# Altium schematic sheet Battery Management.SchDoc: Battery Management
size A4; Organization: Altium Limited; Address1: L3, 12a Rodborough Rd; Address2: Frenchs Forest; Address3: NSW; Address4: Australia 2086; DocumentNumber: 7; Revision: D; SheetNumber: 7; SheetTotal: 7; Status: Develop
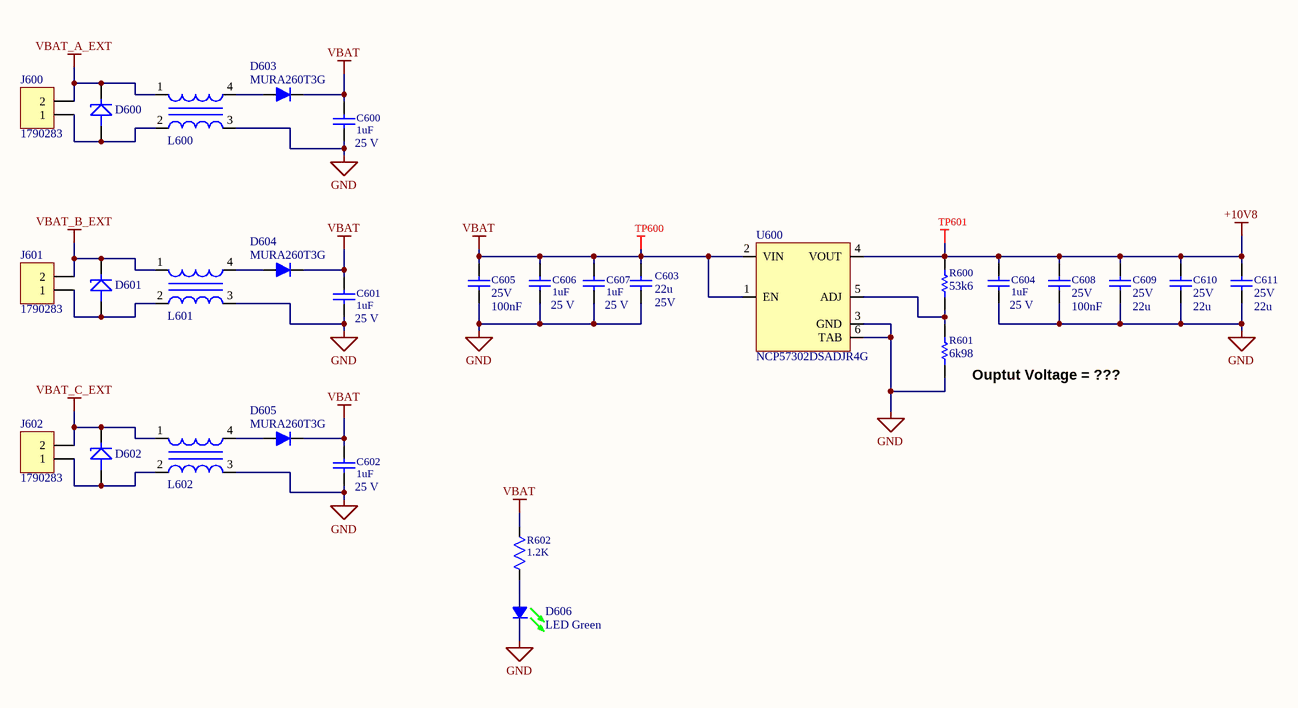
[diagram p0: Battery Management.SchDoc]

## Parts
C600  1uF  Voltage: 25 V  [C1608[0603] small]
C601  1uF  Voltage: 25 V  [C1608[0603] small]
C602  1uF  Voltage: 25 V  [C1608[0603] small]
C603  value 22u  Voltage: 25V  [CAPC2012X14N]
C604  1uF  Voltage: 25 V  [C1608[0603] small]
C605  value 100nF  Voltage: 25V  [CAPC1005X06N]  (hidden comment: 4.7uF)
C606  1uF  Voltage: 25 V  [C1608[0603] small]
C607  1uF  Voltage: 25 V  [C1608[0603] small]
C608  value 100nF  Voltage: 25V  [CAPC1005X06N]  (hidden comment: 4.7uF)
C609  value 22u  Voltage: 25V  [CAPC2012X14N]
C610  value 22u  Voltage: 25V  [CAPC2012X14N]
C611  value 22u  Voltage: 25V  [CAPC2012X14N]
D600  12V TVS  [NXP PTVSxS1UR-Series (SOD123W)]  (value not drawn)
D601  12V TVS  [NXP PTVSxS1UR-Series (SOD123W)]  (value not drawn)
D602  12V TVS  [NXP PTVSxS1UR-Series (SOD123W)]  (value not drawn)
D603  MURA260T3G  [Diode SMA DIOM5226X240N]
D604  MURA260T3G  [Diode SMA DIOM5226X240N]
D605  MURA260T3G  [Diode SMA DIOM5226X240N]
D606  LED Green  [LED_0603]
J600  1790283  [5.08mm 2pos TermBlock]
J601  1790283  [5.08mm 2pos TermBlock]
J602  1790283  [5.08mm 2pos TermBlock]
L600  CM3421Y600R-10  [CM3421Y600R-10]  (value not drawn)
L601  CM3421Y600R-10  [CM3421Y600R-10]  (value not drawn)
L602  CM3421Y600R-10  [CM3421Y600R-10]  (value not drawn)
R600  value 53k6  [RESC1608X06N]  (hidden comment: RES: GENERAL)
R601  value 6k98  [RESC1608X06N]  (hidden comment: RES: GENERAL)
R602  1.2K  [R1608[0603] small]
TP600  PAD  [TP_SMD_39MIL]  (value not drawn)  (no BOM)
TP601  PAD  [TP_SMD_39MIL]  (value not drawn)  (no BOM)
U600  NCP57302DSADJR4G  [D2PAK-5]

## Nets
+10V8: C604.2 C608.1 C609.1 C610.1 C611.1 R600.1 TP601.1 U600.4(VOUT)
GND: C600.1 C601.1 C602.1 C603.2 C604.1 C605.2 C606.1 C607.1 C608.2 C609.2 C610.2 C611.2 D606.2 L600.3 L601.3 L602.3 R601.2 U600.3(GND) U600.6(TAB)
VBAT: C600.2 C601.2 C602.2 C603.1 C605.1 C606.2 C607.2 D603.1(K) D604.1(K) D605.1(K) R602.2 TP600.1 U600.1(EN) U600.2(VIN)
VBAT_A_EXT: D600.1 J600.2 L600.1
VBAT_B_EXT: D601.1 J601.2 L601.1
VBAT_C_EXT: D602.1 J602.2 L602.1
NetD600_2: D600.2 J600.1 L600.2
NetD601_2: D601.2 J601.1 L601.2
NetD602_2: D602.2 J602.1 L602.2
NetD603_2: D603.2(A) L600.4
NetD604_2: D604.2(A) L601.4
NetD605_2: D605.2(A) L602.4
NetD606_1: D606.1 R602.1
NetR600_2: R600.2 R601.1 U600.5(ADJ)

## Notes on the sheet
- (near R601) Ouptut Voltage = ???
- Title
- Size:
- Date:
- A4
- Number:
- Time:
- Revision:
- Sheet
- of
- File:

## Library data of the parts
C600-C602 C604 C606 C607 = 1uF_0603_25V: CAP 1µF 25V ±10% X7R 0603; Manufacturer: Samsung; Manufacturer Part Number: CL10B105KA8NNNC; TZOA PN: 211-00001; Value: 1u; Supplier 1: Digi-Key; Stock 1: 622934; Pricing 1: 1=0.1, 10=0.069, 100=0.0307, 500=0.0219, 1000=0.0172 (USD); Capacitance: 1 µF; Case Size/Dimension: 0603; Dielectric: X7R; Tolerance (%): ±10 %; ComponentLink1URL: https://datasheet.ciiva.com/16449/cl10b105ka8nnnc-16449544.pdf; ComponentLink1Description: https://datasheet.ciiva.com/16449/cl10b105ka8nnnc-16449544.pdf; ComponentLink2URL: https://datasheet.ciiva.com/15195/getdatasheetpartid-359554-15195726.pdf; ComponentLink2Description: https://datasheet.ciiva.com/15195/getdatasheetpartid-359554-15195726.pdf; Supplier Part Number 1: 1276-1184-1-ND
C603 C609-C611 = 4.7uF_0603_10V: Manufacturer Part Number: GRM21BR61E226ME44K; Manufacturer: Murata; ComponentLink1URL: http://www.murata.com/~/media/webrenewal/support/library/catalog/products/capacitor/mlcc/c02e.pdf; ComponentLink1Description: http://www.murata.com/~/media/webrenewal/support/library/catalog/products/capacitor/mlcc/c02e.pdf; Supplier 1: Digi-Key; Supplier Part Number 1: 490-14661-1-ND
C605 C608 = 4.7uF_0603_10V: Manufacturer Part Number: CL05A104KA5NNNC; Manufacturer: Samsung; ComponentLink1URL: http://www.murata.com/~/media/webrenewal/support/library/catalog/products/capacitor/mlcc/c02e.pdf; ComponentLink1Description: http://www.murata.com/~/media/webrenewal/support/library/catalog/products/capacitor/mlcc/c02e.pdf; Supplier 1: Digi-Key; Supplier Part Number 1: 1276-1043-1-ND
D600-D602 = NXP PTVSxS1UR-Series: Manufacturer: Nexperia; Manufacturer Part Number: PTVS12VS1UR,115; Supplier 1: Digi-Key; Supplier Part Number 1: 1727-5325-1-ND
D603-D605 = MURA260T3G: Diode Standard 600V 2A Surface Mount SMA; Manufacturer: ON Semi; Properties: 2A/600V; Supplier Part Number 1: MURA260T3GOSCT-ND; Supplier 1: Digi-Key; Package: SMA; Manufacturer Part Number: MURA260T3G
D606 = Green LED: LED Green Diffused 0603; Manufacturer: Rohm; Manufacturer Part Number: SML-D12M8WT86; TZOA PN: XXX; Intensity: 100 mcd; Forward (Drive) Current: 20 mA; Forward Voltage: 2.2 V; Supplier 1: Digi-Key; Stock 1: 105158; Pricing 1: 1=0.34, 10=0.251, 25=0.1848, 100=0.132, 250=0.0898, 500=0.0792, 1000=0.062 (USD); Color: Green; Dimension: 0603; Lens Type: Diffused; ComponentLink1URL: https://datasheet.ciiva.com/11774/0900766b80df3ada-11774260.pdf; ComponentLink1Description: https://datasheet.ciiva.com/11774/0900766b80df3ada-11774260.pdf; ComponentLink2URL: https://datasheet.ciiva.com/3161/sml-d1-3161419.pdf; ComponentLink2Description: https://datasheet.ciiva.com/3161/sml-d1-3161419.pdf; ComponentLink3URL: https://datasheet.ciiva.com/2110/sml-d1-2110396.pdf; ComponentLink3Description: https://datasheet.ciiva.com/2110/sml-d1-2110396.pdf; ComponentLink4URL: https://datasheet.ciiva.com/2110/sml-d1-2110397.pdf; ComponentLink4Description: https://datasheet.ciiva.com/2110/sml-d1-2110397.pdf; ComponentLink5URL: https://datasheet.ciiva.com/2110/sml-d1-2110398.pdf; ComponentLink5Description: https://datasheet.ciiva.com/2110/sml-d1-2110398.pdf; Supplier Part Number 1: 511-1578-1-ND; Digikey PN: 511-1578-1-ND
J600-J602 = TERM BLOCK 2POS 45DEG 5.08MM: 5.08mm Spring Cage, Tension Clamp, Pheonix Contact, 2pos, THD; Manufacturer: Phoenix Contact; Supplier Part Number 1: 277-6722-ND; Manufacturer Part Number: 1790283; Supplier 1: Digi-Key
L600-L602 = CM3421Y600R-10: 2 Line Common Mode Choke Surface Mount 60 Ohms @ 100MHz 15A DCR 0.75mOhm; Manufacturer: Laird; Manufacturer Part Number: CM3421Y600R-10; Value: *; Supplier 1: Digi-Key; Supplier Part Number 1: 240-2501-1-ND
R600 = RES: GENERAL: Manufacturer: Panasonic; Manufacturer Part Number: ERA-3AEB5362V; Accuracy: *; Distributor Part Number: *; Power: *; Type: *; Distributor: Digi-Key; Package: *; Supplier 1: Digi-Key; Supplier Part Number 1: P53.6KDBCT-ND
R601 = RES: GENERAL: Manufacturer: Panasonic; Manufacturer Part Number: ERA-3AEB6981V; Accuracy: *; Power: *; Type: *; Package: *; Supplier 1: Digi-Key; Supplier Part Number 1: P6.98KDBCT-ND
R602 = 1K00_0603_0.1W: RES 1K Ohm ±5%, 0.25W,1/4W 0603; Manufacturer: Yageo; Manufacturer Part Number: RC0603FR-071K2L; Supplier 1: Digi-Key; Resistance (Ohms): 1k; ComponentLink1URL: https://datasheet.ciiva.com/2469/esr-2469603.pdf; ComponentLink1Description: https://datasheet.ciiva.com/2469/esr-2469603.pdf; ComponentLink2URL: https://datasheet.ciiva.com/2469/esr-2469604.pdf; ComponentLink2Description: https://datasheet.ciiva.com/2469/esr-2469604.pdf; ComponentLink3URL: https://datasheet.ciiva.com/2469/esr-2469605.pdf; ComponentLink3Description: https://datasheet.ciiva.com/2469/esr-2469605.pdf; Supplier Part Number 1: 311-1.20KHRCT-ND
TP600 TP601 = TP_SMD_39MIL: SMD Test Pad; Manufacturer: No P/N Required; P/N: No P/N; UM: EA; Fast Supplier: No P/N Required; Fast Supplier P/N: No P/N Required; Manufacturer P/N: No P/N Required
U600 = NCP57302DSADJR4G: Linear Voltage Regulator IC Positive Adjustable 1 Output  3A D2PAK-5; Manufacturer: ON Semiconductor; Manufacturer Part Number: NCP57302DSADJR4G; Supplier 1: Digi-Key; Supplier Part Number 1: NCP57302DSADJR4GOSCT-ND